# EAGLE schematic hkk_project (EAGLE 9.6.2)
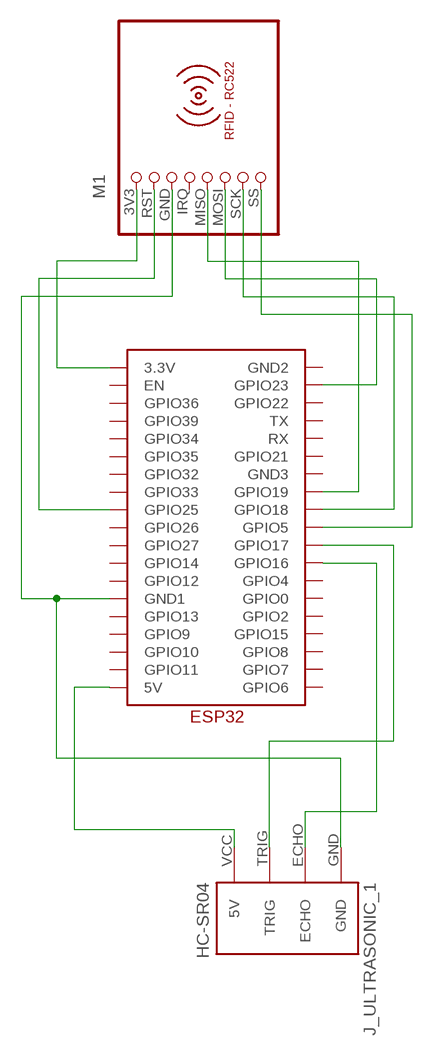
[diagram p0: schematic, sheet 1]

## Parts
J_ULTRASONIC_1  HC-SR04  [HC-SR04_FOOTPRINT]
M1  RFID-RC522  [RFID-RC522]
U$1  ESP32_GRBL  [ESP32_GRBL]

## Nets
N$1: J_ULTRASONIC_1.VCC(5V) U$1.5V
N$2: J_ULTRASONIC_1.GND M1.GND U$1.GND1
N$3: J_ULTRASONIC_1.TRIG U$1.GPIO17
N$4: J_ULTRASONIC_1.ECHO U$1.GPIO16
N$5: M1.3V3 U$1.3.3V
N$6: M1.RST U$1.GPIO25
N$7: M1.MISO U$1.GPIO19
N$8: M1.MOSI U$1.GPIO23
N$9: M1.SCK U$1.GPIO18
N$10: M1.SS U$1.GPIO5
Unconnected: M1.IRQ U$1.EN U$1.GND2 U$1.GND3 U$1.GPIO0 U$1.GPIO2 U$1.GPIO4 U$1.GPIO6 U$1.GPIO7 U$1.GPIO8 U$1.GPIO9 U$1.GPIO10 U$1.GPIO11 U$1.GPIO12 U$1.GPIO13 U$1.GPIO14 U$1.GPIO15 U$1.GPIO21 U$1.GPIO22 U$1.GPIO26 U$1.GPIO27 U$1.GPIO32 U$1.GPIO33 U$1.GPIO34 U$1.GPIO35 U$1.GPIO36 U$1.GPIO39 U$1.RX U$1.TX

## Library data of the parts
J_ULTRASONIC_1 = Ultrasonic Sensor HC-SR04:HC-SR04: Ultrasonic Sensor HC-SR04
M1 = mfrc522-module:RFID-RC522: RFID-RC522 MFRC-522 based breakout board
U$1 = esp32:ESP32_GRBL